# Altium schematic sheet Sheet1.SchDoc
size A4; SheetNumber: 1; SheetTotal: 4
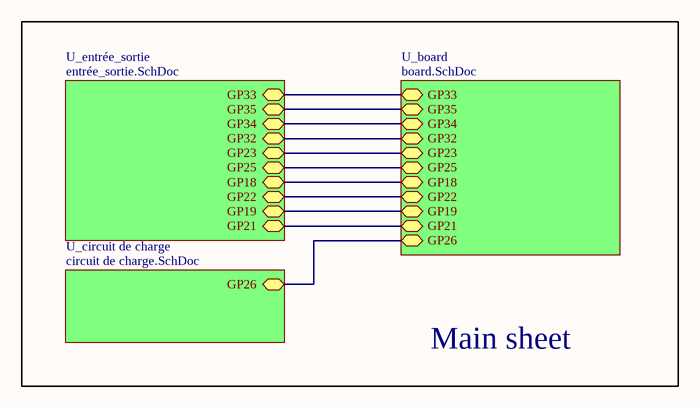
[diagram p0: Sheet1.SchDoc]

## Sub-sheets
U_board = board.SchDoc: GP33 (bidir), GP35 (bidir), GP34 (bidir), GP32 (bidir), GP23 (bidir), GP25 (bidir), GP18 (bidir), GP22 (bidir), GP26 (bidir), GP21 (bidir), GP19 (bidir)
U_circuit de charge = circuit de charge.SchDoc: GP26 (bidir)
U_entrée_sortie = entrée_sortie.SchDoc: GP23 (bidir), GP22 (bidir), GP21 (bidir), GP19 (bidir), GP18 (bidir), GP34 (bidir), GP35 (bidir), GP32 (bidir), GP33 (bidir), GP25 (bidir)

## Nets
(unnamed): sheet U_circuit de charge/GP26, sheet U_board/GP26
(unnamed): sheet U_entrée_sortie/GP23, sheet U_board/GP23
(unnamed): sheet U_entrée_sortie/GP22, sheet U_board/GP22
(unnamed): sheet U_entrée_sortie/GP21, sheet U_board/GP21
(unnamed): sheet U_entrée_sortie/GP19, sheet U_board/GP19
(unnamed): sheet U_entrée_sortie/GP18, sheet U_board/GP18
(unnamed): sheet U_entrée_sortie/GP34, sheet U_board/GP34
(unnamed): sheet U_entrée_sortie/GP35, sheet U_board/GP35
(unnamed): sheet U_entrée_sortie/GP32, sheet U_board/GP32
(unnamed): sheet U_entrée_sortie/GP33, sheet U_board/GP33
(unnamed): sheet U_entrée_sortie/GP25, sheet U_board/GP25

## Notes on the sheet
- Main sheet